# EAGLE design diwali lights 1 (EAGLE 9.6.2)
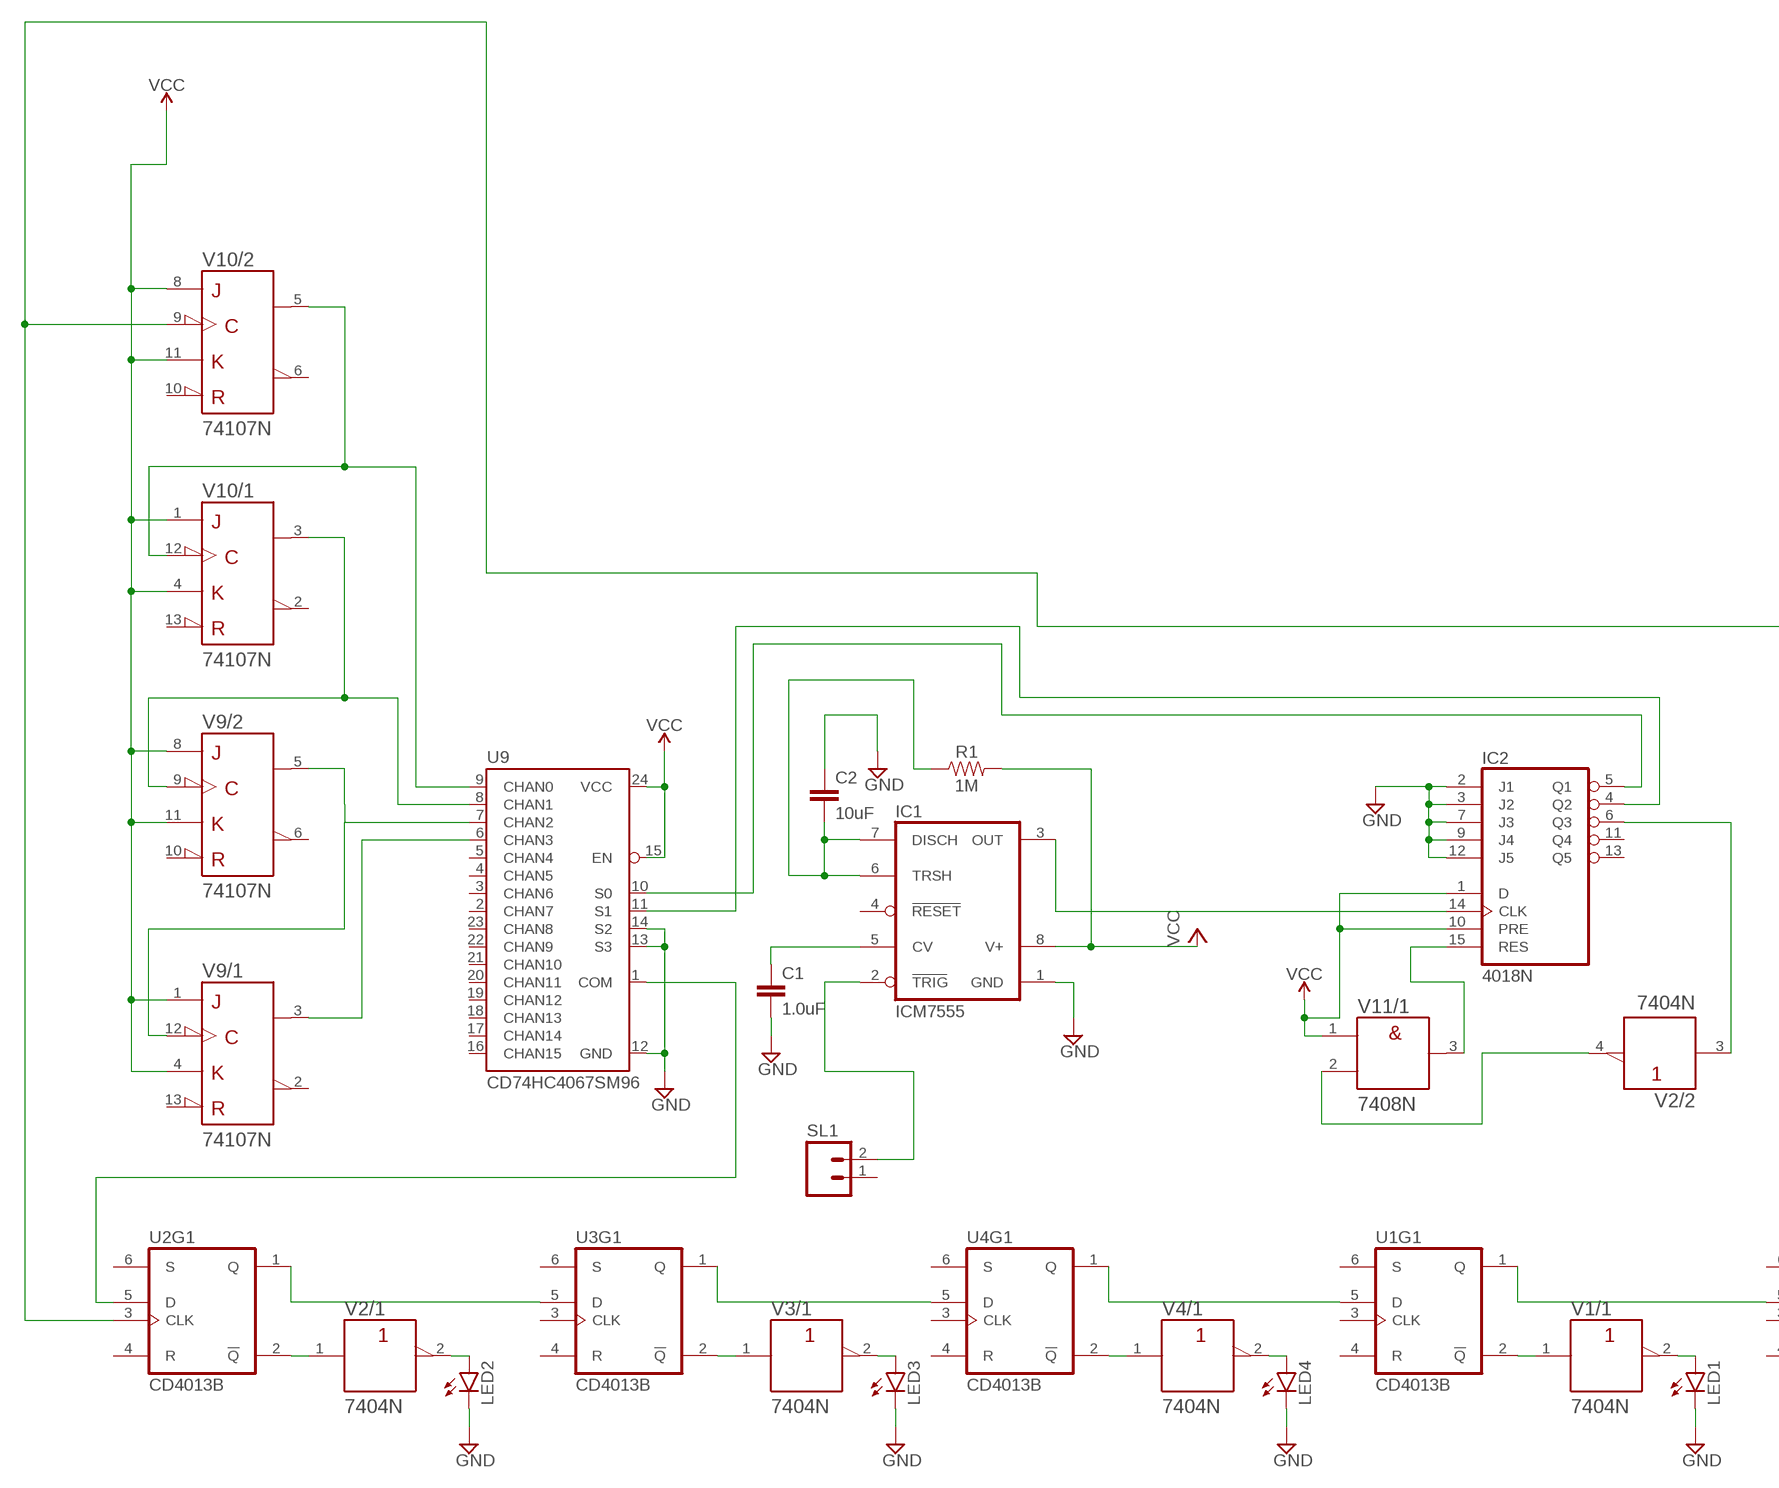
[diagram p0: schematic, sheet 1, part 1 of 2]
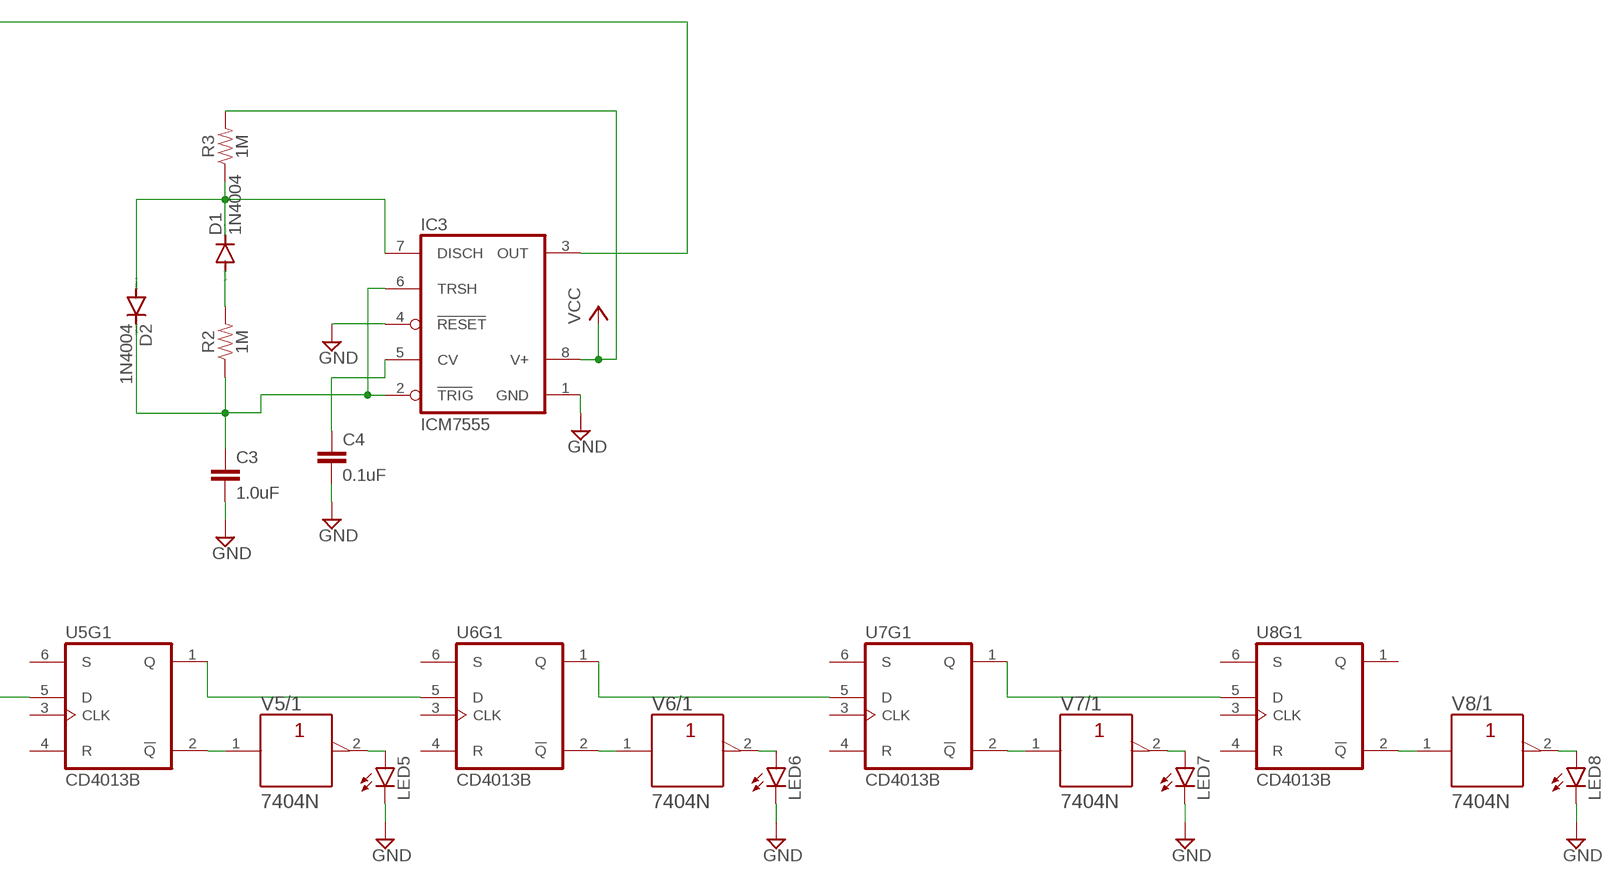
[diagram p1: schematic, sheet 1, part 2 of 2]

## Parts
C1  1.0uF  1.0UF-0402-16V-10%  [0402]
C2  10uF  10UF-0805-10V-10%  [0805]
C3  1.0uF  1.0UF-0402-16V-10%  [0402]
C4  0.1uF  0.1UF-0402-16V-10%  [0402]
D1  1N4004  [DO41-10]
D2  1N4004  [DO41-10]
IC1  ICM7555  [DIL08]
IC2  4018N  [DIL16]
IC3  ICM7555  [DIL08]
LED1  LED5MM  [LED5MM]
LED2  LED5MM  [LED5MM]
LED3  LED5MM  [LED5MM]
LED4  LED5MM  [LED5MM]
LED5  LED5MM  [LED5MM]
LED6  LED5MM  [LED5MM]
LED7  LED5MM  [LED5MM]
LED8  LED5MM  [LED5MM]
R1  1M  1MOHM-0402-1/16W-5%  [0402]
R2  1M  1MOHM-HORIZ-1/4W-5%  [AXIAL-0.3]
R3  1M  1MOHM-HORIZ-1/4W-5%  [AXIAL-0.3]
SL1  M02  [02P]
U1  CD4013B  CD4013  [DIP14-KIT]
U2  CD4013B  CD4013  [DIP14-KIT]
U3  CD4013B  CD4013  [DIP14-KIT]
U4  CD4013B  CD4013  [DIP14-KIT]
U5  CD4013B  CD4013  [DIP14-KIT]
U6  CD4013B  CD4013  [DIP14-KIT]
U7  CD4013B  CD4013  [DIP14-KIT]
U8  CD4013B  CD4013  [DIP14-KIT]
U9  CD74HC4067SM96  74HC4067SM96  [SSOP24]
V1  7404N  [DIL14]
V2  7404N  [DIL14]
V3  7404N  [DIL14]
V4  7404N  [DIL14]
V5  7404N  [DIL14]
V6  7404N  [DIL14]
V7  7404N  [DIL14]
V8  7404N  [DIL14]
V9  74107N  [DIL14]
V10  74107N  [DIL14]
V11  7408N  [DIL14]

## Nets
GND: C1.2 C2.1 C3.2 C4.2 IC1.1(GND) IC2.2(J1) IC2.3(J2) IC2.7(J3) IC2.9(J4) IC2.12(J5) IC3.1(GND) IC3.4(RESET) LED1.K(C) LED2.K(C) LED3.K(C) LED4.K(C) LED5.K(C) LED6.K(C) LED7.K(C) LED8.K(C) U9.12(GND) U9.13(S3) U9.14(S2)
N$1: U1.2(!Q) V1.1(/1:A)
N$2: LED1.A V1.2(/1:Y)
N$3: U2.2(!Q) V2.1(/1:A)
N$4: LED2.A V2.2(/1:Y)
N$5: U3.2(!Q) V3.1(/1:A)
N$6: LED3.A V3.2(/1:Y)
N$7: U4.2(!Q) V4.1(/1:A)
N$8: LED4.A V4.2(/1:Y)
N$9: U5.2(!Q) V5.1(/1:A)
N$10: LED5.A V5.2(/1:Y)
N$11: U6.2(!Q) V6.1(/1:A)
N$12: LED6.A V6.2(/1:Y)
N$13: U7.2(!Q) V7.1(/1:A)
N$14: LED7.A V7.2(/1:Y)
N$15: U8.2(!Q) V8.1(/1:A)
N$16: LED8.A V8.2(/1:Y)
N$17: U2.1(Q) U3.5(D)
N$18: U7.1(Q) U8.5(D)
N$19: U3.1(Q) U4.5(D)
N$20: U1.5(D) U4.1(Q)
N$21: U1.1(Q) U5.5(D)
N$22: U5.1(Q) U6.5(D)
N$23: U6.1(Q) U7.5(D)
N$24: U9.6(CHAN3) V9.3(/1:Q)
N$25: U2.5(D) U9.1(COM)
N$26: U9.9(CHAN0) V10.5(/2:Q) V10.12(/1:CLK)
N$27: U9.8(CHAN1) V9.9(/2:CLK) V10.3(/1:Q)
N$28: U9.7(CHAN2) V9.5(/2:Q) V9.12(/1:CLK)
N$29: C3.1 D2.C IC3.2(TRIG) IC3.6(TRSH) R2.P$1
N$30: C2.2 IC1.6(TRSH) IC1.7(DISCH) R1.1
N$31: C1.1 IC1.5(CV)
N$32: IC1.2(TRIG) SL1.2
N$34: IC2.6(Q3) V2.3(/2:A)
N$35: V2.4(/2:Y) V11.2(/1:B)
N$37: IC1.3(OUT) IC2.14(CLK)
N$38: IC2.15(RES) V11.3(/1:Y)
N$39: IC2.5(Q1) U9.10(S0)
N$40: IC2.4(Q2) U9.11(S1)
N$42: D1.A R2.P$2
N$43: D1.C D2.A IC3.7(DISCH) R3.P$1
N$45: C4.1 IC3.5(CV)
N$46: IC3.3(OUT) U2.3(CLK) V10.9(/2:CLK)
VCC: IC1.8(V+) IC2.1(D) IC2.10(PRE) IC3.8(V+) R1.2 R3.P$2 U9.15(EN) U9.24(VCC) V9.1(/1:J) V9.4(/1:K) V9.8(/2:J) V9.11(/2:K) V10.1(/1:J) V10.4(/1:K) V10.8(/2:J) V10.11(/2:K) V11.1(/1:A)
Unconnected: IC1.4(RESET) IC2.11(Q4) IC2.13(Q5) SL1.1 U1.3(CLK) U1.4(R) U1.6(S) U1.7(P$V-) U1.8(S) U1.9(D) U1.10(R) U1.11(CLK) U1.12(!Q) U1.13(Q) U1.14(P$V+) U2.4(R) U2.6(S) U2.7(P$V-) U2.8(S) U2.9(D) U2.10(R) U2.11(CLK) U2.12(!Q) U2.13(Q) U2.14(P$V+) U3.3(CLK) U3.4(R) U3.6(S) U3.7(P$V-) U3.8(S) U3.9(D) U3.10(R) U3.11(CLK) U3.12(!Q) U3.13(Q) U3.14(P$V+) U4.3(CLK) U4.4(R) U4.6(S) U4.7(P$V-) U4.8(S) U4.9(D) U4.10(R) U4.11(CLK) U4.12(!Q) U4.13(Q) U4.14(P$V+) U5.3(CLK) U5.4(R) U5.6(S) U5.7(P$V-) U5.8(S) U5.9(D) U5.10(R) U5.11(CLK) U5.12(!Q) U5.13(Q) U5.14(P$V+) U6.3(CLK) U6.4(R) U6.6(S) U6.7(P$V-) U6.8(S) U6.9(D) U6.10(R) U6.11(CLK) U6.12(!Q) U6.13(Q) U6.14(P$V+) U7.3(CLK) U7.4(R) U7.6(S) U7.7(P$V-) U7.8(S) U7.9(D) U7.10(R) U7.11(CLK) U7.12(!Q) U7.13(Q) U7.14(P$V+) U8.1(Q) U8.3(CLK) U8.4(R) U8.6(S) U8.7(P$V-) U8.8(S) U8.9(D) U8.10(R) U8.11(CLK) U8.12(!Q) U8.13(Q) U8.14(P$V+) U9.2(CHAN7) U9.3(CHAN6) U9.4(CHAN5) U9.5(CHAN4) U9.16(CHAN15) U9.17(CHAN14) U9.18(CHAN13) U9.19(CHAN12) U9.20(CHAN11) U9.21(CHAN10) U9.22(CHAN9) U9.23(CHAN8) V1.3(/2:A) V1.4(/2:Y) V1.5(/3:A) V1.6(/3:Y) V1.8(/4:Y) V1.9(/4:A) V1.10(/5:Y) V1.11(/5:A) V1.12(/6:Y) V1.13(/6:A) V2.5(/3:A) V2.6(/3:Y) V2.8(/4:Y) V2.9(/4:A) V2.10(/5:Y) V2.11(/5:A) V2.12(/6:Y) V2.13(/6:A) V3.3(/2:A) V3.4(/2:Y) V3.5(/3:A) V3.6(/3:Y) V3.8(/4:Y) V3.9(/4:A) V3.10(/5:Y) V3.11(/5:A) V3.12(/6:Y) V3.13(/6:A) V4.3(/2:A) V4.4(/2:Y) V4.5(/3:A) V4.6(/3:Y) V4.8(/4:Y) V4.9(/4:A) V4.10(/5:Y) V4.11(/5:A) V4.12(/6:Y) V4.13(/6:A) V5.3(/2:A) V5.4(/2:Y) V5.5(/3:A) V5.6(/3:Y) V5.8(/4:Y) V5.9(/4:A) V5.10(/5:Y) V5.11(/5:A) V5.12(/6:Y) V5.13(/6:A) V6.3(/2:A) V6.4(/2:Y) V6.5(/3:A) V6.6(/3:Y) V6.8(/4:Y) V6.9(/4:A) V6.10(/5:Y) V6.11(/5:A) V6.12(/6:Y) V6.13(/6:A) V7.3(/2:A) V7.4(/2:Y) V7.5(/3:A) V7.6(/3:Y) V7.8(/4:Y) V7.9(/4:A) V7.10(/5:Y) V7.11(/5:A) V7.12(/6:Y) V7.13(/6:A) V8.3(/2:A) V8.4(/2:Y) V8.5(/3:A) V8.6(/3:Y) V8.8(/4:Y) V8.9(/4:A) V8.10(/5:Y) V8.11(/5:A) V8.12(/6:Y) V8.13(/6:A) V9.2(/1:!Q) V9.6(/2:!Q) V9.10(/2:!CLR) V9.13(/1:!CLR) V10.2(/1:!Q) V10.6(/2:!Q) V10.10(/2:!CLR) V10.13(/1:!CLR) V11.4(/2:A) V11.5(/2:B) V11.6(/2:Y) V11.8(/3:Y) V11.9(/3:A) V11.10(/3:B) V11.11(/4:Y) V11.12(/4:A) V11.13(/4:B)

## Power pins joined to a net without a drawn wire
+UB: V1.14(/+UB:+UB) V2.14(/+UB:+UB) V3.14(/+UB:+UB) V4.14(/+UB:+UB) V5.14(/+UB:+UB) V6.14(/+UB:+UB) V7.14(/+UB:+UB) V8.14(/+UB:+UB) V9.14(/+UB:+UB) V10.14(/+UB:+UB) V11.14(/+UB:+UB)
-UB: V1.7(/-UB:-UB) V2.7(/-UB:-UB) V3.7(/-UB:-UB) V4.7(/-UB:-UB) V5.7(/-UB:-UB) V6.7(/-UB:-UB) V7.7(/-UB:-UB) V8.7(/-UB:-UB) V9.7(/-UB:-UB) V10.7(/-UB:-UB) V11.7(/-UB:-UB)
VDD: IC2.16(VDD)
VSS: IC2.8(VSS)

## Library data of the parts
C1 C3 = SparkFun-Capacitors:1.0UF: 1µF ceramic capacitors A capacitor is a passive two-terminal electrical component used to store electrical energy temporarily in an electric field.; PROD_ID: CAP-12417
C2 = SparkFun-Capacitors:10UF: 10.0µF ceramic capacitors A capacitor is a passive two-terminal electrical component used to store electrical energy temporarily in an electric field.; PROD_ID: CAP-11330
C4 = SparkFun-Capacitors:0.1UF: 0.1µF ceramic capacitors A capacitor is a passive two-terminal electrical component used to store electrical energy temporarily in an electric field.; PROD_ID: CAP-12416
D1 D2 = diode:1N4004: DIODE general purpose rectifier, 1 A
IC1 IC3 = maxim:ICM7555: TIMER; MF: MAXIM; MPN: ICM7555IPA+; OC_FARNELL: 9663762; OC_NEWARK: 68K4387
IC2 = 40xx:4018: COUNTER/DIVIDER
LED1-LED8 = led:LED: LED OSRAM: - CHIPLED LG R971, LG N971, LY N971, LG Q971, LY Q971, LO R971, LY R971 LH N974, LH R974 LS Q976, LO Q976, LY Q976 LO Q996 - Hyper CHIPLED LW Q18S LB Q993, LB Q99A, LB R99A - SideLED LS A670, LO A670, LY A670, LG A670, LP A670 LB A673, LV A673, LT A673, LW A673 LH A674 LY A675 LS A676, LA A676, LO A676, LY A676, LW A676 LS A679, LY A679, LG A679 - Hyper Micro SIDELED® LS Y876, LA Y876, LO Y876, LY Y876 LT Y87S - SmartLED LW L88C, LW L88S LB L89C, LB L89S, LG L890 LS L89K, LO L89K, LY L89K LS L896, LA L896, LO L896, LY L896 - TOPLED LS T670, LO T670, LY T670, LG T670, LP T670 LSG T670, LSP T670, LSY T670, LOP T670, LYG T670 LG T671, LOG T671, LSG T671 LB T673, LV T673, LT T673, LW T673 LH T674 LS T676, LA T676, LO T676, LY T676, LB T676, LH T676, LSB T676, LW T676 LB T67C, LV T67C, LT T67C, LS T67K, LO T67K, LY T67K, LW E67C LS E67B, LA E67B, LO E67B, LY E67B, LB E67C, LV E67C, LT E67C LW T67C LS T679, LY T679, LG T679 LS T770, LO T770, LY T770, LG T770, LP T770 LB T773, LV T773, LT T773, LW T773 LH T774 LS E675, LA E675, LY E675, LS T675 LS T776, LA T776, LO T776, LY T776, LB T776 LHGB T686 LT T68C, LB T68C - Hyper Mini TOPLED® LB M676 - Mini TOPLED Santana® LG M470 LS M47K, LO M47K, LY M47K Source: http://www.osram.convergy.de LUXEON: - LUMILED® LXK2-PW12-R00, LXK2-PW12-S00, LXK2-PW14-U00, LXK2-PW14-V00 LXK2-PM12-R00, LXK2-PM12-S00, LXK2-PM14-U00 LXK2-PE12-Q00, LXK2-PE12-R00, LXK2-PE12-S00, LXK2-PE14-T00, LXK2-PE14-U00 LXK2-PB12-K00, LXK2-PB12-L00, LXK2-PB12-M00, LXK2-PB14-N00, LXK2-PB14-P00, LXK2-PB14-Q00 LXK2-PR12-L00, LXK2-PR12-M00, LXK2-PR14-Q00, LXK2-PR14-R00 LXK2-PD12-Q00, LXK2-PD12-R00, LXK2-PD12-S00 LXK2-PH12-R00, LXK2-PH12-S00 LXK2-PL12-P00, LXK2-PL12-Q00, LXK2-PL12-R00 Source: www.luxeon.com KINGBRIGHT: KA-3528ASYC Source: www.kingbright.com
R1 = SparkFun-Resistors:1MOHM: 1MΩ resistor A resistor is a passive two-terminal electrical component that implements electrical resistance as a circuit element. Resistors act to reduce current flow, and, at the same time, act to lower voltage levels within circuits. - Wikipedia; PROD_ID: RES-15185
R2 R3 = SparkFun-Resistors:1MOHM: 1MΩ resistor A resistor is a passive two-terminal electrical component that implements electrical resistance as a circuit element. Resistors act to reduce current flow, and, at the same time, act to lower voltage levels within circuits. - Wikipedia; PROD_ID: RES-09329
SL1 = con-amp-quick:M02: AMP QUICK CONNECTOR; OC_FARNELL: unknown; OC_NEWARK: unknown
U1-U8 = SparkFun-IC-Logic:CD4013: Dual D-type Flip-Flop Datasheet <https://cdn.sparkfun.com/datasheets/Kits/CD4013B.pdf> SparkFun Products SparkFun SparkPunk Sound Kit <https://www.sparkfun.com/products/11177> (KIT-11177) SparkFun SparkPunk Sequencer Kit <https://www.sparkfun.com/products/12707> (KIT-12707); PROD_ID: IC-11896
U9 = SparkFun-IC-Logic:74*4067: 16-channel analog MUX Datasheet <http://www.sparkfun.com/datasheets/IC/cd74hc4067.pdf> SparkFun Products MP3 Trigger <https://www.sparkfun.com/products/13720> (WIG-13720) SparkFun Analog/Digital MUX Breakout - CD74HC4067 <https://www.sparkfun.com/products/9056> (BOB-09056); PROD_ID: IC-08252
V1-V8 = 74ttl-din:74*04: Hex INVERTER
V9 V10 = 74ttl-din:74*107: Dual J-K FLIP FLOP, clear
V11 = 74ttl-din:74*08: Quad 2-input AND gate

## Board
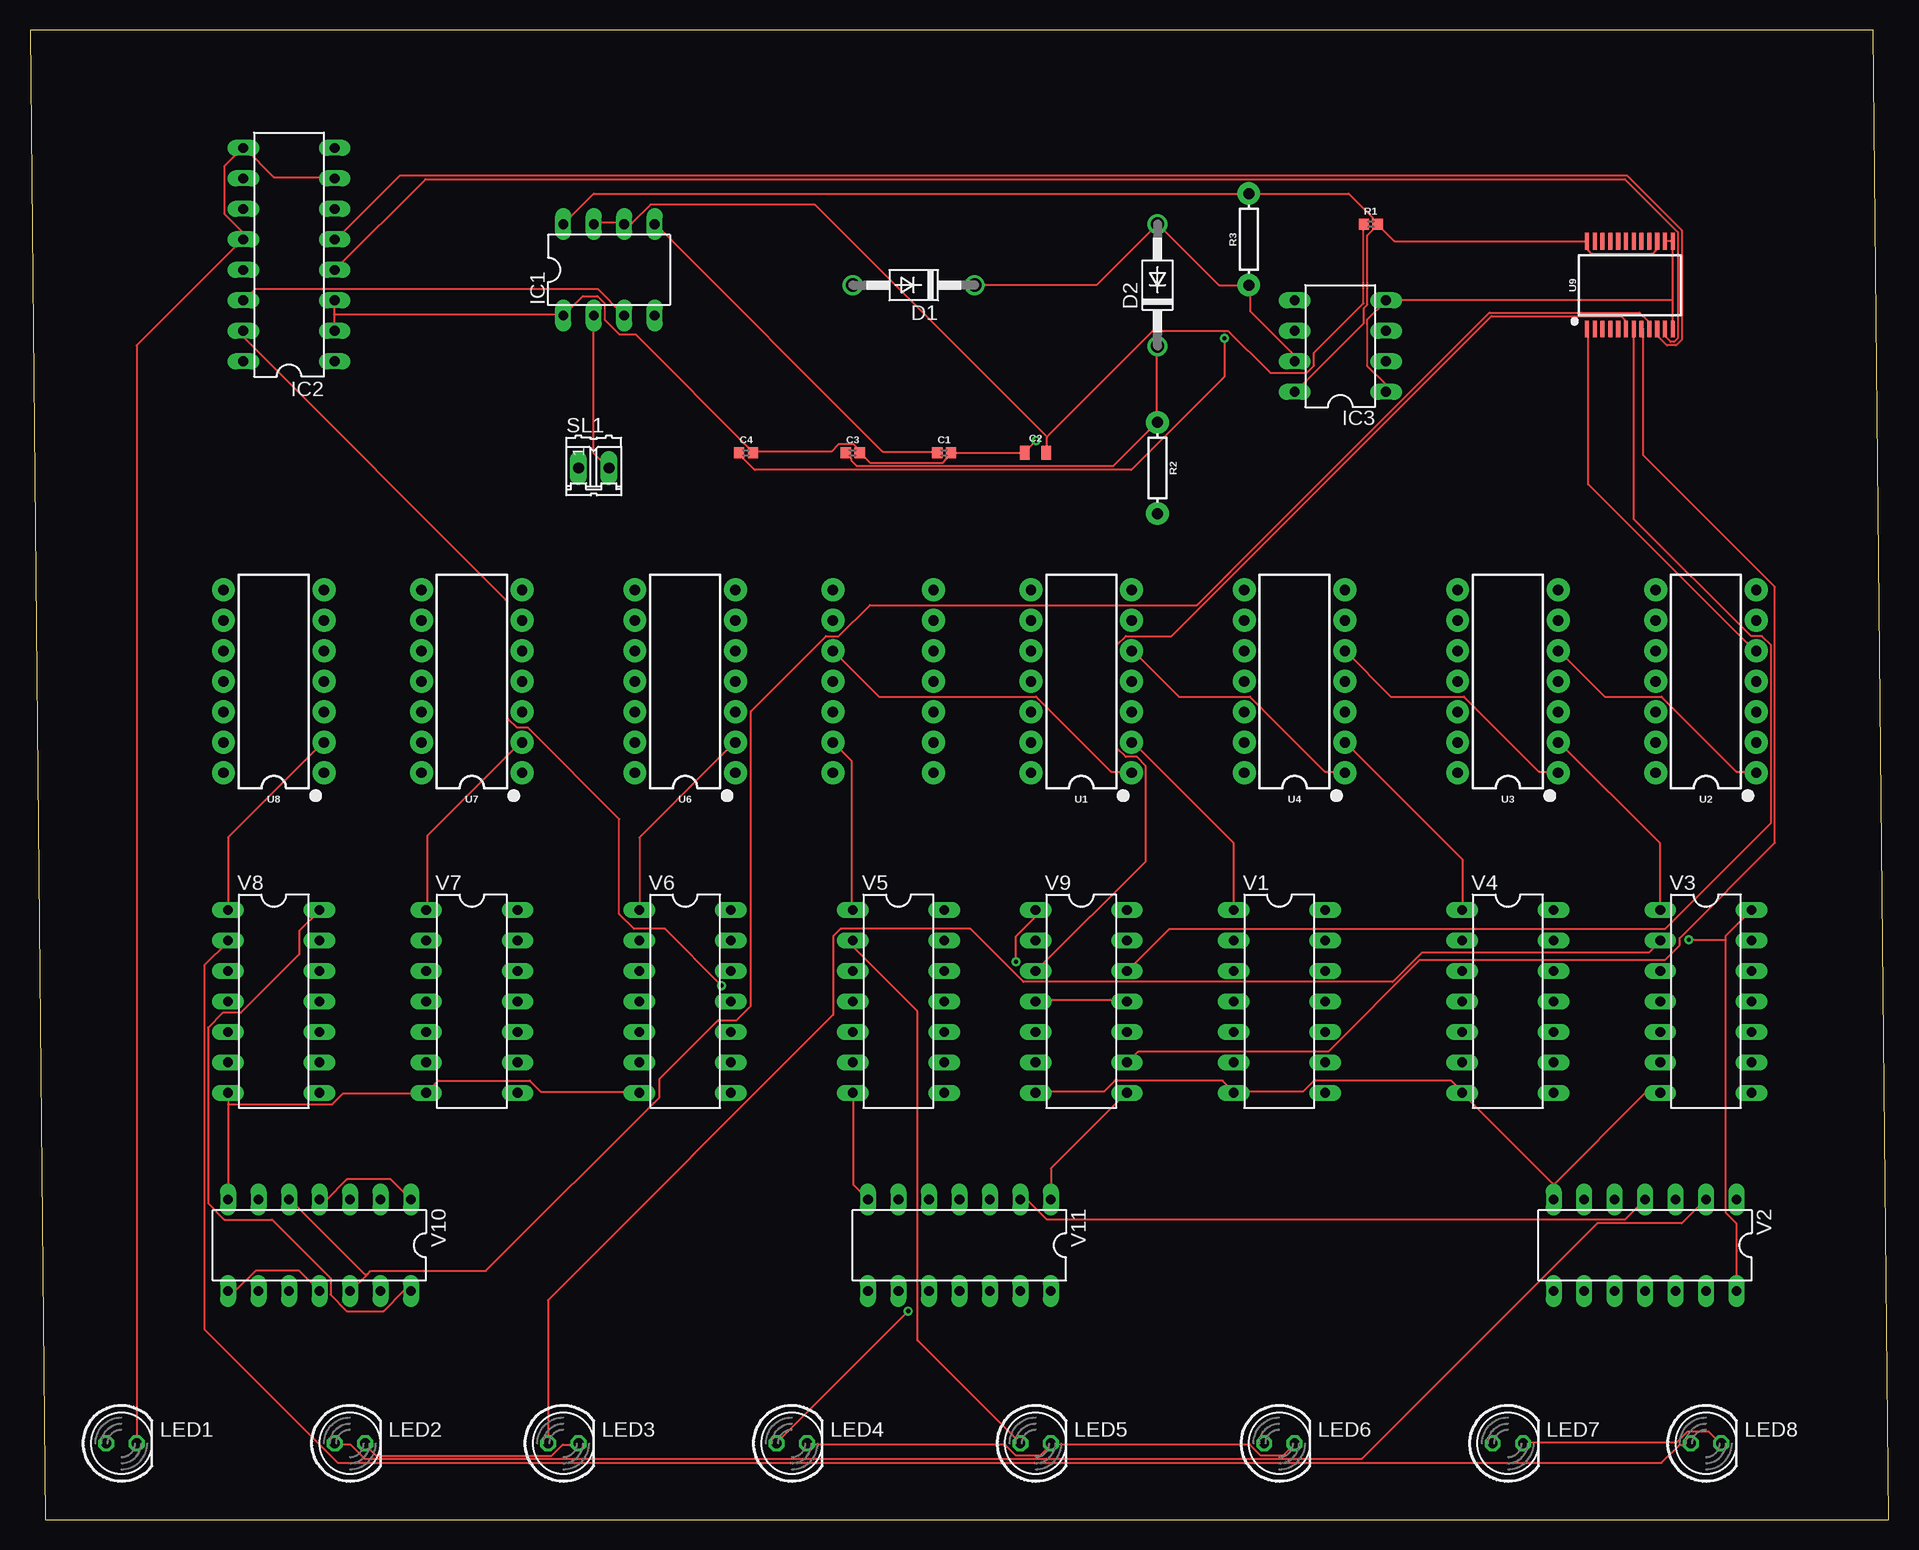
[diagram p2: board, top side]
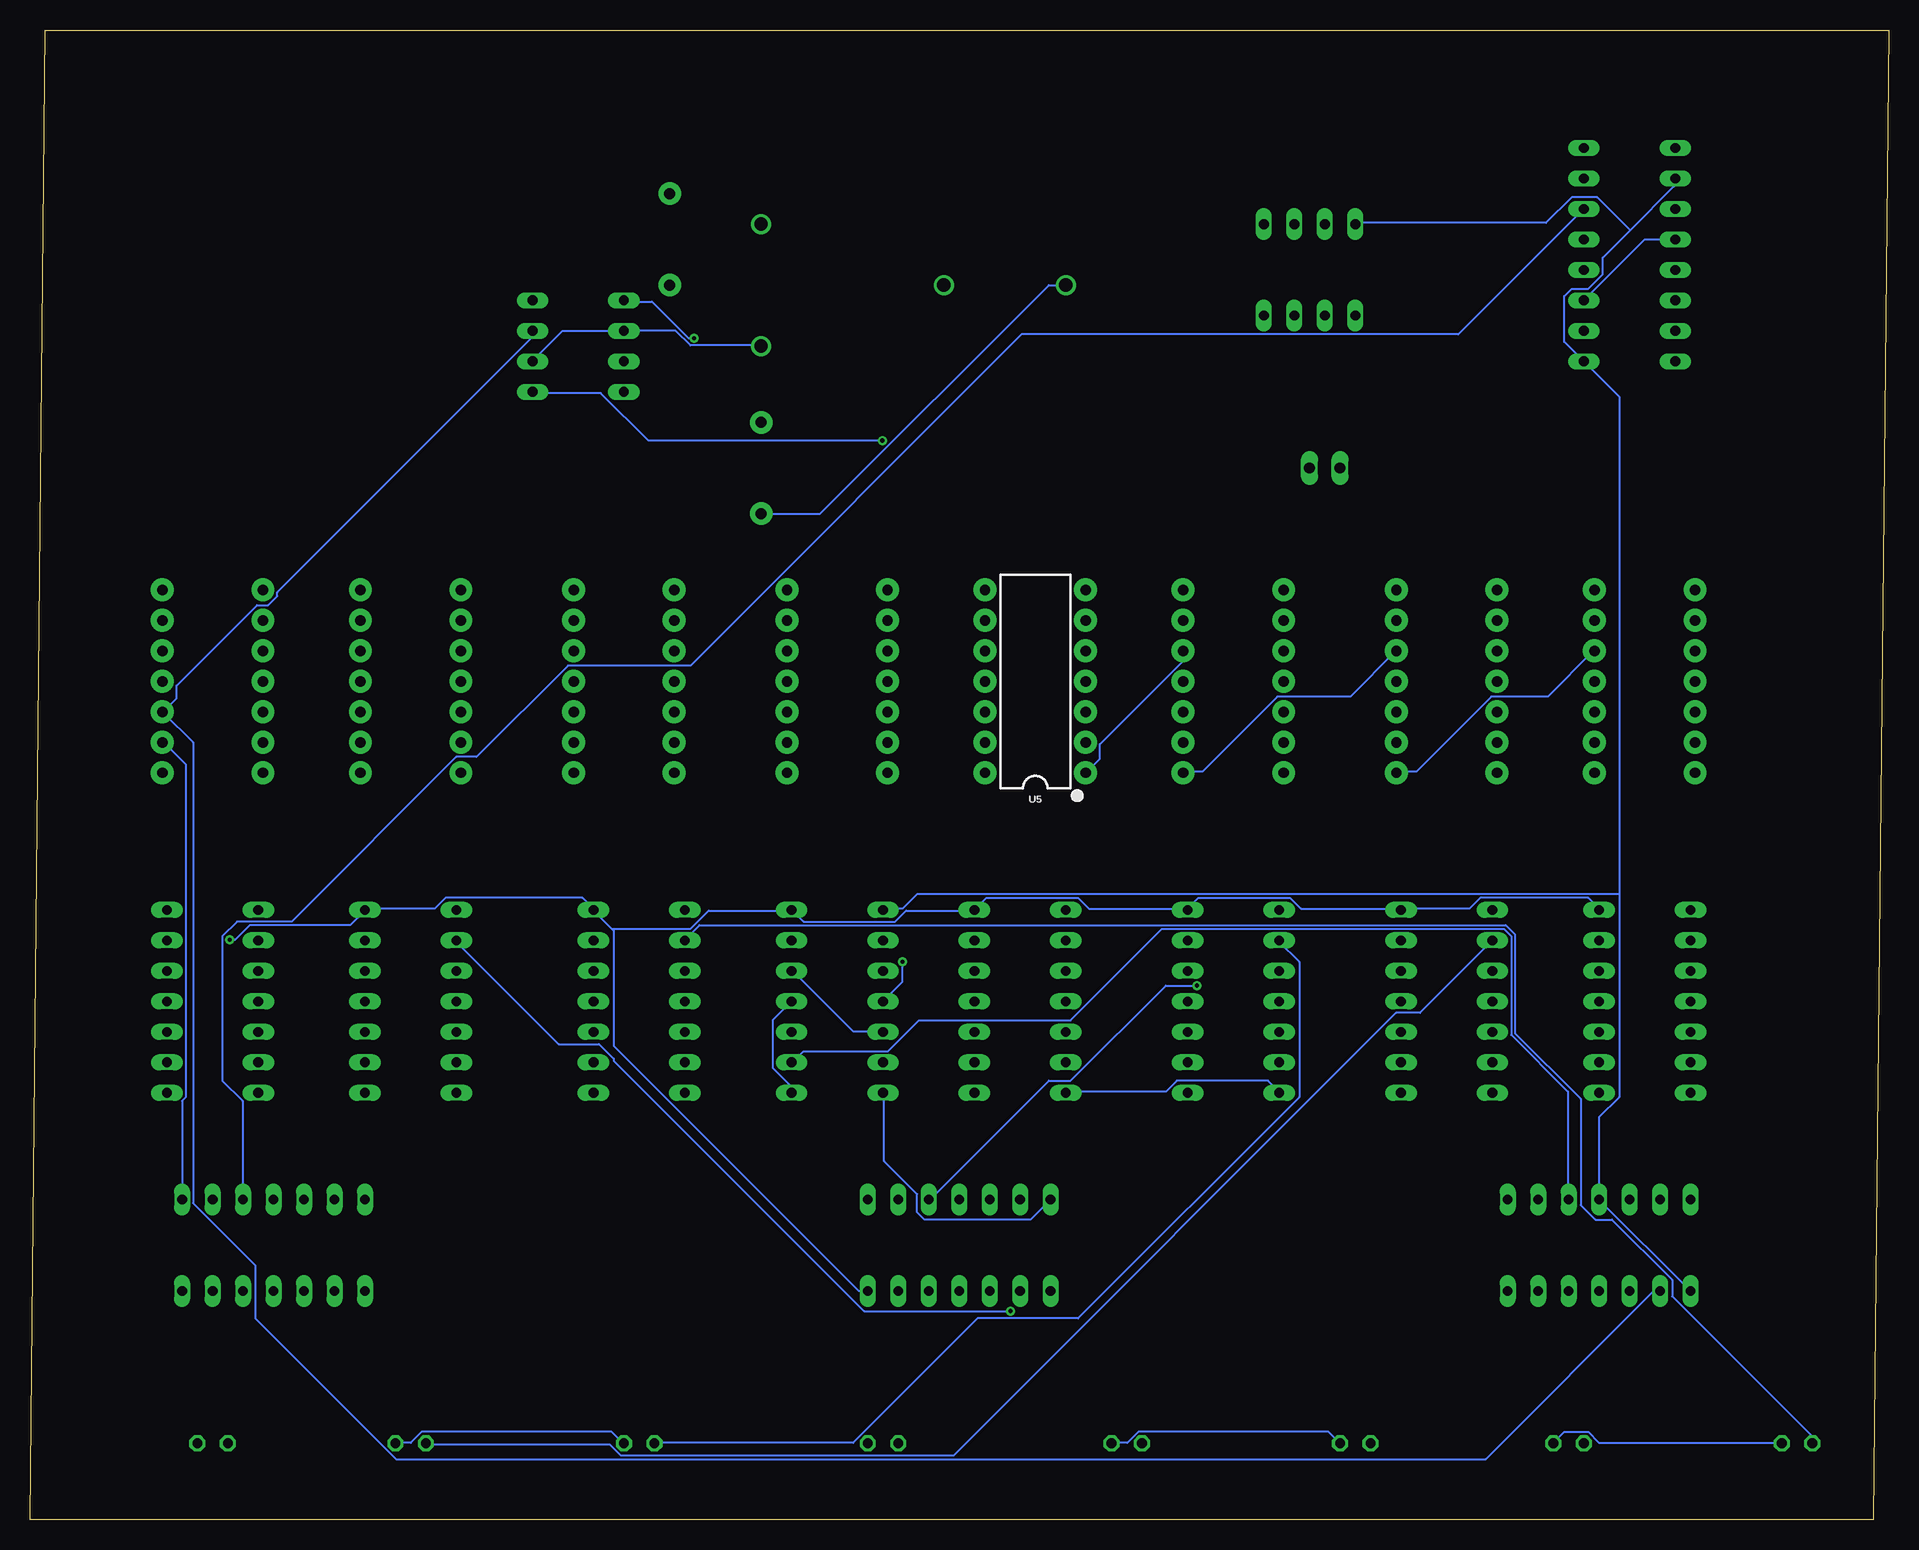
[diagram p3: board, bottom side, seen from below]

Size 154.92 x 124.13 mm. Coordinates in mm from the lower left corner, seen from the top.
Outline: 1.27,0 154.92,0 153.65,124.13 0,124.13 1.27,0
Copper layers (1*16): Top 0.035mm / dielectric 1.5mm / Bottom 0.035mm
Design rules "default": minimum track width 6mil, minimum drill 0.35mm, track to track 6mil, track to pad 6mil, pad to pad 6mil, via to via 6mil, smd to smd 6mil, copper to edge 40mil, drill to drill 6mil, minimum pad ring 10mil, minimum via ring 8mil, stop-mask expansion 4mil, vias tented up to drill 0mil, thermal gap 10mil

### Footprints (pad centres in the part's own frame; a part is rotated, then mirrored left to right if it is on the bottom)
0402 = smd 0.85 x 0.9: 1 -0.58,0; 2 0.58,0
0805 = smd 0.8 x 1.2: 1 -0.9,0; 2 0.9,0
DO41-10 = drill 1.118: A 5.08,0; C -5.08,0
DIL08 = drill 0.813 long: 1 -3.81,-3.81; 2 -1.27,-3.81; 3 1.27,-3.81; 4 3.81,-3.81; 5 3.81,3.81; 6 1.27,3.81; 7 -1.27,3.81; 8 -3.81,3.81
DIL16 = drill 0.813 long: 1 -8.89,-3.81; 2 -6.35,-3.81; 3 -3.81,-3.81; 4 -1.27,-3.81; 5 1.27,-3.81; 6 3.81,-3.81; 7 6.35,-3.81; 8 8.89,-3.81; 9 8.89,3.81; 10 6.35,3.81; 11 3.81,3.81; 12 1.27,3.81; 13 -1.27,3.81; 14 -3.81,3.81; 15 -6.35,3.81; 16 -8.89,3.81
LED5MM = drill 0.813 octagon: A -1.27,0; K 1.27,0
AXIAL-0.3 = drill 0.9 pad 1.88: P$1 -3.81,0; P$2 3.81,0
02P = drill 0.914 long: 1 -1.27,0; 2 1.27,0
DIP14-KIT = drill 0.864 pad 1.905: 1 -8.89,-4.191; 2 -6.35,-4.191; 3 -3.81,-4.191; 4 -1.27,-4.191; 5 1.27,-4.191; 6 3.81,-4.191; 7 6.35,-4.191; 8 6.35,4.191; 9 3.81,4.191; 10 1.27,4.191; 11 -1.27,4.191; 12 -3.81,4.191; 13 -6.35,4.191; 14 -8.89,4.191
SSOP24 = smd 0.348 x 1.397: 1 -3.575,-3.656; 2 -2.925,-3.656; 3 -2.275,-3.656; 4 -1.625,-3.656; 5 -0.975,-3.656; 6 -0.325,-3.656; 7 0.325,-3.656; 8 0.975,-3.656; 9 1.625,-3.656; 10 2.275,-3.656; 11 2.925,-3.656; 12 3.575,-3.656; 13 3.575,3.656; 14 2.925,3.656; 15 2.275,3.656; 16 1.625,3.656; 17 0.975,3.656; 18 0.325,3.656; 19 -0.325,3.656; 20 -0.975,3.656; 21 -1.625,3.656; 22 -2.275,3.656; 23 -2.925,3.656; 24 -3.575,3.656
DIL14 = drill 0.813 long: 1 -7.62,-3.81; 2 -5.08,-3.81; 3 -2.54,-3.81; 4 0,-3.81; 5 2.54,-3.81; 6 5.08,-3.81; 7 7.62,-3.81; 8 7.62,3.81; 9 5.08,3.81; 10 2.54,3.81; 11 0,3.81; 12 -2.54,3.81; 13 -5.08,3.81; 14 -7.62,3.81

### Placement (x,y rotation side)
C1  76.2,88.9 0 top
C2  83.82,88.9 0 top
C3  68.58,88.9 0 top
C4  59.69,88.9 0 top
D1  73.66,102.87 180 top
D2  93.98,102.87 90 top
IC1  48.26,104.14 0 top
IC2  21.59,105.41 90 top
IC3  109.22,97.79 90 top
LED1  7.62,6.35 0 top
LED2  26.67,6.35 0 top
LED3  44.45,6.35 0 top
LED4  63.5,6.35 0 top
LED5  83.82,6.35 0 top
LED6  104.14,6.35 0 top
LED7  123.19,6.35 0 top
LED8  139.7,6.35 0 top
R1  111.76,107.95 0 top
R2  93.98,87.63 270 top
R3  101.6,106.68 90 top
SL1  46.99,87.63 0 top
U1  87.63,71.12 90 top
U2  139.7,71.12 90 top
U3  123.19,71.12 90 top
U4  105.41,71.12 90 top
U5  71.12,71.12 90 bottom
U6  54.61,71.12 90 top
U7  36.83,71.12 90 top
U8  20.32,71.12 90 top
U9  133.35,102.87 0 top
V1  104.14,43.18 270 top
V2  134.62,22.86 180 top
V3  139.7,43.18 270 top
V4  123.19,43.18 270 top
V5  72.39,43.18 270 top
V6  54.61,43.18 270 top
V7  36.83,43.18 270 top
V8  20.32,43.18 270 top
V9  87.63,43.18 270 top
V10  24.13,22.86 180 top
V11  77.47,22.86 180 top

### Tracks (layer width: path | path; a pad name or v marks a point on that pad's centre or on a via)
+UB  (via drill 0.35)
  Top 0.152: V10.14 31.14,19.05 29.46,17.37 26.42,17.37 25.04,18.75 25.04,20.12 20.17,24.99 16.21,24.99 14.83,26.36 14.83,41 16.05,42.22 17.58,42.22 22.45,47.09 22.45,49.07 24.13,50.75 V8.14 | V2.14 142.24,24.69 141.33,25.6 141.33,48.31 | 141.33,48.31 141.33,48.62 V3.14 | v138.28,48.31 141.33,48.31
  Bottom 0.152: V8.14 24.13,50.9 25.04,51.82 34.04,51.82 34.95,50.9 40.59,50.9 V7.14 40.74,50.9 48.97,50.9 49.89,51.82 57.51,51.82 58.42,50.9 | 58.42,50.9 66.65,50.9 67.56,51.82 75.18,51.82 V5.14 76.25,50.75 81.89,50.75 82.8,49.84 90.42,49.84 91.34,50.75 V9.14 91.49,50.75 98.35,50.75 99.87,49.23 106.43,49.23 | V11.14 85.85,19.05 106.27,39.47 106.27,49.07 106.43,49.23 | 106.43,49.23 107.95,50.75 V1.14 107.95,50.9 108.86,51.82 120.29,51.82 121.21,50.9 127,50.9 V4.14 127,50.75 128.22,49.53 136.6,49.53 137.82,48.31 v138.28,48.31 | 58.42,50.9 V6.14
-UB
  Top 0.152: 100.33,35.66 99.42,36.58 90.42,36.58 89.51,35.66 83.87,35.66 V9.7 | 127,27.89 119.38,35.51 V4.7 119.38,35.66 118.47,36.58 107.04,36.58 106.12,35.66 100.33,35.66 | 127,27.89 134.62,35.51 135.84,35.51 V3.7 | 127,27.89 V2.7 | 100.33,35.66 V1.7 | V11.7 68.63,27.89 68.63,35.51 V5.7 | V8.7 16.51,34.59 | 16.51,34.59 V10.7 | 16.51,34.59 25.2,34.59 26.11,35.51 32.97,35.51 V7.7 34.04,36.58 41.66,36.58 42.57,35.66 50.8,35.66 V6.7
  Bottom 0.152: V5.7 68.48,35.66 60.25,35.66 59.33,36.58 51.71,36.58 50.8,35.66 V6.7 | V11.7 71.53,24.99 80.37,24.99 80.97,25.6 80.97,27.13 83.72,29.87 83.72,35.51 V9.7
GND  (via drill 0.35)
  Top 0.152: LED3.K 45.62,6.25 44.4,6.25 43.49,5.33 28.85,5.33 27.94,6.25 LED2.K | LED7.K 124.56,6.4 137.21,6.4 138.12,7.32 139.95,7.32 140.87,6.4 LED8.K | 85.09,6.25 101.7,6.25 102.62,5.33 104.44,5.33 105.36,6.25 LED6.K | 85.09,6.25 84.18,5.33 82.19,5.33 81.28,6.25 64.82,6.25 LED4.K | 85.09,6.25 LED5.K | U9.14 136.3,106.53 136.91,106.53 U9.13 136.91,106.38 136.91,101.65 | 136.91,101.65 136.91,99.36 U9.12 | IC3.1 112.98,94.03 112.98,94.64 111.45,96.16 111.45,99.97 112.98,101.5 IC3.4 113.13,101.65 136.91,101.65 | 17.73,106.68 17.73,107.29 16.21,108.81 16.21,112.78 17.73,114.3 IC2.9 17.88,114.3 20.32,111.86 25.35,111.86 IC2.7 | 25.35,100.43 25.35,101.5 IC2.3 | 25.35,100.43 25.35,99.06 IC2.2 | 25.35,100.43 44.4,100.43 IC1.1 46.08,101.96 47.3,101.96 47.9,101.35 47.9,99.97 49.12,98.75 50.5,98.75 60.25,89 C4.2 60.4,89 66.8,89 67.41,89.61 68.63,89.61 69.24,89 C3.2 69.24,88.85 70,88.09 76.1,88.09 76.4,88.39 76.4,88.54 76.71,88.85 C1.2 76.86,88.85 82.8,88.85 C2.1 82.96,89 v83.87,89.92 | LED1.K 8.89,97.84 17.73,106.68 | 17.73,106.68 IC2.12
  Bottom 0.152: LED1.K 8.89,6.4 24.13,6.4 25.04,7.32 27.03,7.32 27.94,6.4 LED2.K | LED3.K 46.69,7.32 62.54,7.32 63.45,6.4 64.67,6.4 LED4.K | LED7.K 124.41,6.4 123.19,6.4 122.28,7.32 106.43,7.32 105.51,6.4 LED6.K | IC2.12 20.32,106.68 IC2.3 | v83.87,89.92 103.38,89.92 107.34,93.88 112.98,93.88 IC3.1
N$1
  Top 0.152: V1.1 100.33,56.39 91.95,64.77 U1.2
N$2
  Bottom 0.152: LED1.A 6.45,6.4 6.45,7.01 18.03,18.59 18.03,19.96 23.06,24.99 24.43,24.99 25.65,26.21 25.65,35.05 31.14,40.54 31.14,48.77 31.9,49.53 99.11,49.53 100.33,48.31 V1.2
N$3
  Bottom 0.152: V2.1 142.24,34.9 141.94,35.2 141.94,62.94 143.76,64.77 U2.2
N$4
  Top 0.152: LED2.A 25.5,6.25 26.72,6.25 27.94,5.03 111,5.03 130.66,24.69 137.67,24.69 139.65,26.67 V2.2
N$5
  Top 0.152: V3.1 135.84,50.9 135.84,56.39 127.46,64.77 U3.2
N$6
  Top 0.152: LED3.A 43.18,18.29 66.95,42.06 66.95,48.62 67.56,49.23 78.38,49.23 82.8,44.81 113.59,44.81 116.03,47.24 134.93,47.24 135.84,48.16 V3.2
N$7
  Top 0.152: V4.1 119.38,55.02 109.63,64.77 U4.2
N$8  (via drill 0.35)
  Top 0.152: v73.2,17.37 62.23,6.4 LED4.A
  Bottom 0.152: v73.2,17.37 85.39,17.37 106.27,38.25 106.27,38.41 107.49,39.62 110.85,39.62 119.38,48.16 V4.2
N$9
  Top 0.152: V5.1 68.48,50.9 68.48,63.25 66.95,64.77 U5.2
N$10
  Top 0.152: LED5.A 73.96,14.94 73.96,42.37 68.63,47.7 68.63,48.16 V5.2
N$11
  Top 0.152: V6.1 50.8,56.84 58.73,64.77 U6.2
N$12
  Bottom 0.152: LED6.A 102.77,6.4 86.31,6.4 75.95,16.76 67.56,16.76 49.12,35.2 49.12,46.48 50.8,48.16 V6.2
N$13
  Top 0.152: V7.1 33.12,50.9 33.12,57 40.89,64.77 U7.2
N$14
  Bottom 0.152: V7.2 39.07,42.22 41.05,42.22 77.93,5.33 105.66,5.33 106.58,6.25 121.82,6.25 LED7.A
N$15
  Top 0.152: V8.1 16.51,56.84 24.43,64.77 U8.2
N$16
  Top 0.152: LED8.A 138.43,6.25 137.52,6.25 135.99,4.72 25.65,4.72 14.53,15.85 14.53,46.18 16.51,48.16 V8.2
N$17
  Top 0.152: U2.1 143.76,62.33 142.24,62.33 135.99,68.58 131.27,68.58 127.46,72.39 U3.5
N$18
  Bottom 0.152: U7.1 40.89,62.33 39.37,62.33 33.12,68.58 28.4,68.58 24.59,72.39 U8.5
N$19
  Top 0.152: U3.1 127.3,62.33 125.78,62.33 119.53,68.58 113.44,68.58 109.63,72.39 U4.5
N$20
  Top 0.152: U4.1 109.47,62.33 107.95,62.33 101.7,68.58 95.76,68.58 91.95,72.39 U1.5
N$21
  Top 0.152: U1.1 91.8,62.33 90.12,62.33 83.87,68.58 70.76,68.58 66.95,72.39 U5.5
N$22
  Bottom 0.152: U6.5 58.88,72.39 58.88,71.48 65.73,64.62 65.73,63.4 66.8,62.33 U5.1
N$23
  Bottom 0.152: U6.1 58.73,62.33 57.2,62.33 50.95,68.58 44.86,68.58 41.05,72.39 U7.5
N$24
  Top 0.152: U9.6 132.94,99.36 132.94,99.97 132.64,100.28 121.82,100.28 95.15,73.61 91.34,73.61 90.58,72.85 90.58,64.31 91.34,63.55 92.25,63.55 93.02,62.79 93.02,54.86 83.87,45.72 V9.3
N$25
  Top 0.152: U9.1 129.9,99.21 129.9,86.26 143.76,72.39 U2.5
N$26
  Top 0.152: 28.09,20.42 26.72,19.05 V10.12 | 28.09,20.42 28.4,20.73 38,20.73 52.48,35.2 52.48,36.73 57.35,41.6 58.88,41.6 60.1,42.82 60.1,67.36 66.34,73.61 67.41,73.61 70,76.2 97.28,76.2 121.67,100.58 134.16,100.58 134.93,99.82 134.93,99.36 U9.9 | 28.09,20.42 27.94,20.42 21.69,26.67 V10.5
N$27
  Top 0.152: U9.8 134.47,99.21 134.47,88.7 145.44,77.72 145.44,56.39 137.52,48.46 137.52,47.85 136.3,46.63 115.88,46.63 108.25,39.01 92.41,39.01 91.49,38.1 V9.9
  Bottom 0.152: V10.3 26.72,26.67 26.72,35.66 31.45,40.39 31.45,48.62 32.05,49.23 60.55,49.23 68.17,41.6 80.82,41.6 83.41,39.01 90.42,39.01 91.34,38.1 V9.9
N$28
  Top 0.152: U9.7 133.71,99.21 133.71,83.36 143.46,73.61 144.37,73.61 145.14,72.85 145.14,58.06 136.3,49.23 95,49.23 91.49,45.72 V9.12
  Bottom 0.152: V9.5 83.87,40.69 86.31,40.69 91.34,45.72 V9.12
N$29
  Top 0.152: 93.93,91.44 90.27,87.78 68.94,87.78 68.48,88.24 68.48,88.39 68.02,88.85 C3.1 | 93.93,91.44 93.93,97.69 D2.C | 93.93,91.44 R2.P$1
  Bottom 0.152: IC3.2 112.98,96.62 110.54,99.06 IC3.6 101.09,99.06 99.87,97.84 94.08,97.84 D2.C
N$30
  Top 0.152: IC1.7 46.99,108.05 49.43,108.05 IC1.6 49.58,108.05 50.19,108.05 51.71,109.58 65.43,109.58 84.78,90.22 | 84.78,90.22 93.62,99.06 99.87,99.06 103.38,95.56 106.43,95.56 107.04,96.16 107.04,97.23 111.15,101.35 111.15,107.9 R1.1 | 84.78,90.22 84.78,89 C2.2
N$31
  Top 0.152: C1.1 75.49,89 71.07,89 52.17,107.9 IC1.5
N$32
  Top 0.152: IC1.2 46.99,88.85 48.21,87.63 SL1.2
N$34
  Bottom 0.152: IC2.6 35.87,98.75 72.29,98.75 99.87,71.17 110.08,71.17 117.7,63.55 119.38,63.55 133.1,49.84 137.67,49.84 138.89,48.62 138.89,36.58 137.21,34.9 137.21,26.67 V2.3
N$35
  Top 0.152: V11.2 83.11,26.67 84.78,24.99 132.94,24.99 V2.4
N$37
  Top 0.152: IC1.3 47.3,102.56 18.8,102.56 17.88,101.65 IC2.14
N$38  (via drill 0.35)
  Top 0.152: v57.66,44.5 52.93,49.23 50.34,49.23 49.12,50.44 49.12,58.37 41.5,65.99 40.59,65.99 39.83,66.75 39.83,76.5 17.88,98.45 17.88,99.06 IC2.15
  Bottom 0.152: v57.66,44.5 60.25,44.5 68.17,36.58 70,36.58 79.91,26.67 V11.3
N$39
  Top 0.152: U9.10 135.69,99.21 135.69,98.6 136.45,97.84 137.21,97.84 137.67,98.3 137.67,107.44 133.1,112.01 30.84,112.01 25.5,106.68 IC2.5
N$40
  Top 0.152: IC2.4 32.97,111.71 132.94,111.71 137.36,107.29 137.36,98.45 137.06,98.15 136.75,98.15 136.3,98.6 136.3,99.21 U9.11
N$42
  Bottom 0.152: D1.A 70,102.87 89.05,83.82 R2.P$2
N$43
  Top 0.152: IC3.7 105.36,96.62 105.36,97.08 101.7,100.74 101.7,102.87 R3.P$1 99.11,102.87 94.08,107.9 D2.A 88.9,102.87 D1.C
N$45  (via drill 0.35)
  Top 0.152: v99.57,98.45 99.57,95.25 91.8,87.48 60.4,87.48 59.49,88.39 59.49,88.54 59.18,88.85 C4.1
  Bottom 0.152: v99.57,98.45 100.02,98.45 103.07,101.5 105.36,101.5 IC3.5
N$46
  Bottom 0.152: V10.9 19.56,19.05 33.58,5.03 124.41,5.03 136.14,16.76 136.14,21.18 141.33,26.36 141.33,64.77 143.76,67.21 U2.3 143.76,67.36 142.7,68.43 142.7,69.49 135.99,76.2 135.08,76.2 134.31,76.96 134.31,77.27 113.13,98.45 113.13,99.06 IC3.3
VCC  (via drill 0.35)
  Top 0.152: U9.15 135.53,106.38 135.53,105.77 135.23,105.46 130.2,105.46 129.9,105.77 129.9,106.38 U9.24 129.74,106.53 113.74,106.53 112.37,107.9 | 112.37,107.9 111.45,106.98 111.45,101.19 111.15,100.89 111.15,99.67 105.51,94.03 IC3.8 | 112.37,107.9 R1.2 112.22,108.05 111.91,108.36 111.91,108.51 109.93,110.49 R3.P$2 46.99,110.49 IC1.8 | V11.1 85.09,29.26 91.34,35.51 V9.8 | V9.4 83.87,43.28 91.34,43.28 V9.11 | v82.19,46.48 82.19,48.62 83.72,50.14 83.72,50.75 V9.1 | V10.8 17.12,19.05 18.8,20.73 22.45,20.73 V10.11 | V10.4 24.74,26.67 26.42,28.35 30.07,28.35 V10.1
  Bottom 0.152: v82.19,46.48 82.19,44.81 V9.4 | V9.11 93.02,41.6 93.02,37.64 91.49,36.12 91.49,35.66 V9.8 | V10.8 V10.4 24.13,33.53 22.45,35.2 22.45,52.12 | 21.54,107.44 23.82,105.16 23.82,103.78 25.04,102.56 26.42,102.56 27.03,101.96 27.03,98.15 IC2.1 22.45,93.57 22.45,52.12 | 21.54,107.44 17.88,111.1 17.88,111.71 IC2.10 | 21.54,107.44 24.28,110.19 26.42,110.19 28.55,108.05 44.4,108.05 IC1.8 | 22.45,52.12 80.97,52.12 82.19,50.9 83.72,50.9 V9.1